# EAGLE design MainBoard v7.1.3 (EAGLE 7.7.0)

## Sheet 1 of 2: Signal Processing
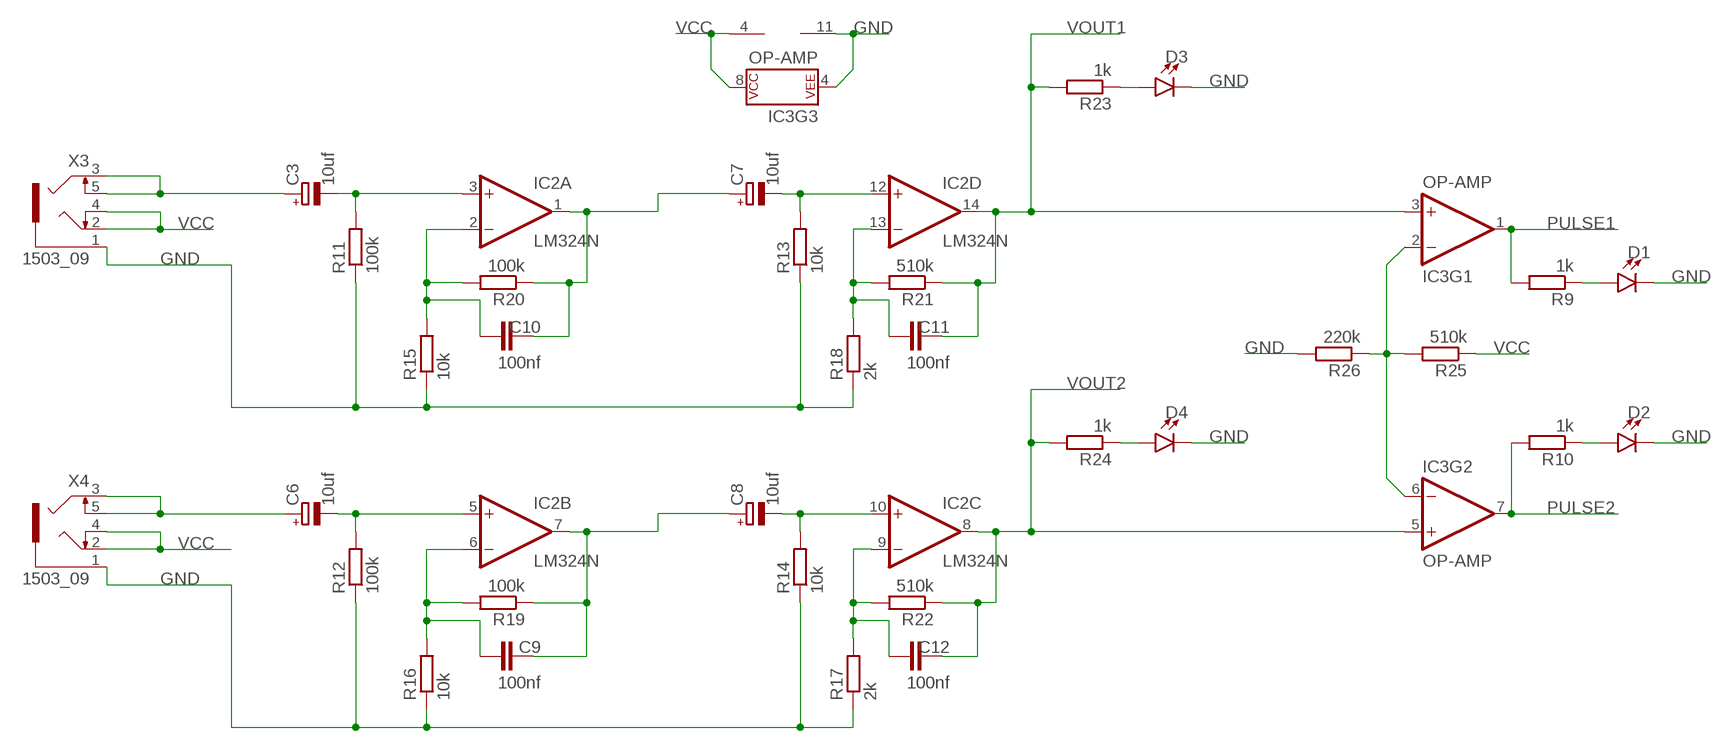
[diagram p0: schematic, sheet 1]

### Parts
C3  10uf  CPOL-EUE2-5  [E2-5]
C6  10uf  CPOL-EUE2-5  [E2-5]
C7  10uf  CPOL-EUE2-5  [E2-5]
C8  10uf  CPOL-EUE2-5  [E2-5]
C9  100nf  C-EU050-030X075  [C050-030X075]
C10  100nf  C-EU050-030X075  [C050-030X075]
C11  100nf  C-EU050-030X075  [C050-030X075]
C12  100nf  C-EU050-030X075  [C050-030X075]
D1  LED5MM  [LED_5MM]
D2  LED5MM  [LED_5MM]
D3  LED5MM  [LED_5MM]
D4  LED5MM  [LED_5MM]
IC2  LM324N  [DIL14]
IC3  OP-AMP  OPAMP-DUALDIP  [DIP08]
R9  1k  R-EU_0207/10  [0207/10]
R10  1k  R-EU_0207/10  [0207/10]
R11  100k  R-EU_0207/10  [0207/10]
R12  100k  R-EU_0207/10  [0207/10]
R13  10k  R-EU_0207/10  [0207/10]
R14  10k  R-EU_0207/10  [0207/10]
R15  10k  R-EU_0207/10  [0207/10]
R16  10k  R-EU_0207/10  [0207/10]
R17  2k  R-EU_0207/10  [0207/10]
R18  2k  R-EU_0207/10  [0207/10]
R19  100k  R-EU_0207/10  [0207/10]
R20  100k  R-EU_0207/10  [0207/10]
R21  510k  R-EU_0207/10  [0207/10]
R22  510k  R-EU_0207/10  [0207/10]
R23  1k  R-EU_0207/10  [0207/10]
R24  1k  R-EU_0207/10  [0207/10]
R25  510k  R-EU_0207/10  [0207/10]
R26  220k  R-EU_0207/10  [0207/10]
X3  1503_09  [1503_09]
X4  1503_09  [1503_09]

### Nets
GND: D1.K(C) D2.K(C) D3.K(C) D4.K(C) IC2.11(P:V-) IC3.4(P$V-) R11.1 R12.1 R13.1 R14.1 R15.1 R16.1 R17.1 R18.1 R26.2 X3.1 X4.1 ; also sheet 2
N$4: C8.+ C9.2 IC2.7(B:OUT) R19.1
N$9: C9.1 IC2.6(B:-IN) R16.2 R19.2
N$11: D1.A R9.1
N$12: C7.+ C10.2 IC2.1(A:OUT) R20.1
N$13: C10.1 IC2.2(A:-IN) R15.2 R20.2
N$15: C11.1 IC2.13(D:-IN) R18.2 R21.2
N$16: IC3.2(-IN) IC3.6(-IN) R25.2 R26.1
N$17: C12.1 IC2.9(C:-IN) R17.2 R22.2
N$18: C6.+ X4.3 X4.5
N$19: D2.A R10.1
N$23: C3.+ X3.3 X3.5
N$24: C6.- IC2.5(B:+IN) R12.2
N$26: C7.- IC2.12(D:+IN) R13.2
N$28: C8.- IC2.10(C:+IN) R14.2
N$35: C3.- IC2.3(A:+IN) R11.2
N$36: D3.A R23.1
N$37: D4.A R24.1
PULSE1: IC3.1(OUT) R9.2 ; also sheet 2
PULSE2: IC3.7(OUT) R10.2 ; also sheet 2
VCC: IC2.4(P:V+) IC3.8(P$V+) R25.1 X3.2 X3.4 X4.2 X4.4 ; also sheet 2
VOUT1: C11.2 IC2.14(D:OUT) IC3.3(+IN) R21.1 R23.2 ; also sheet 2
VOUT2: C12.2 IC2.8(C:OUT) IC3.5(+IN) R22.1 R24.2 ; also sheet 2

## Sheet 2 of 2: Display Segment
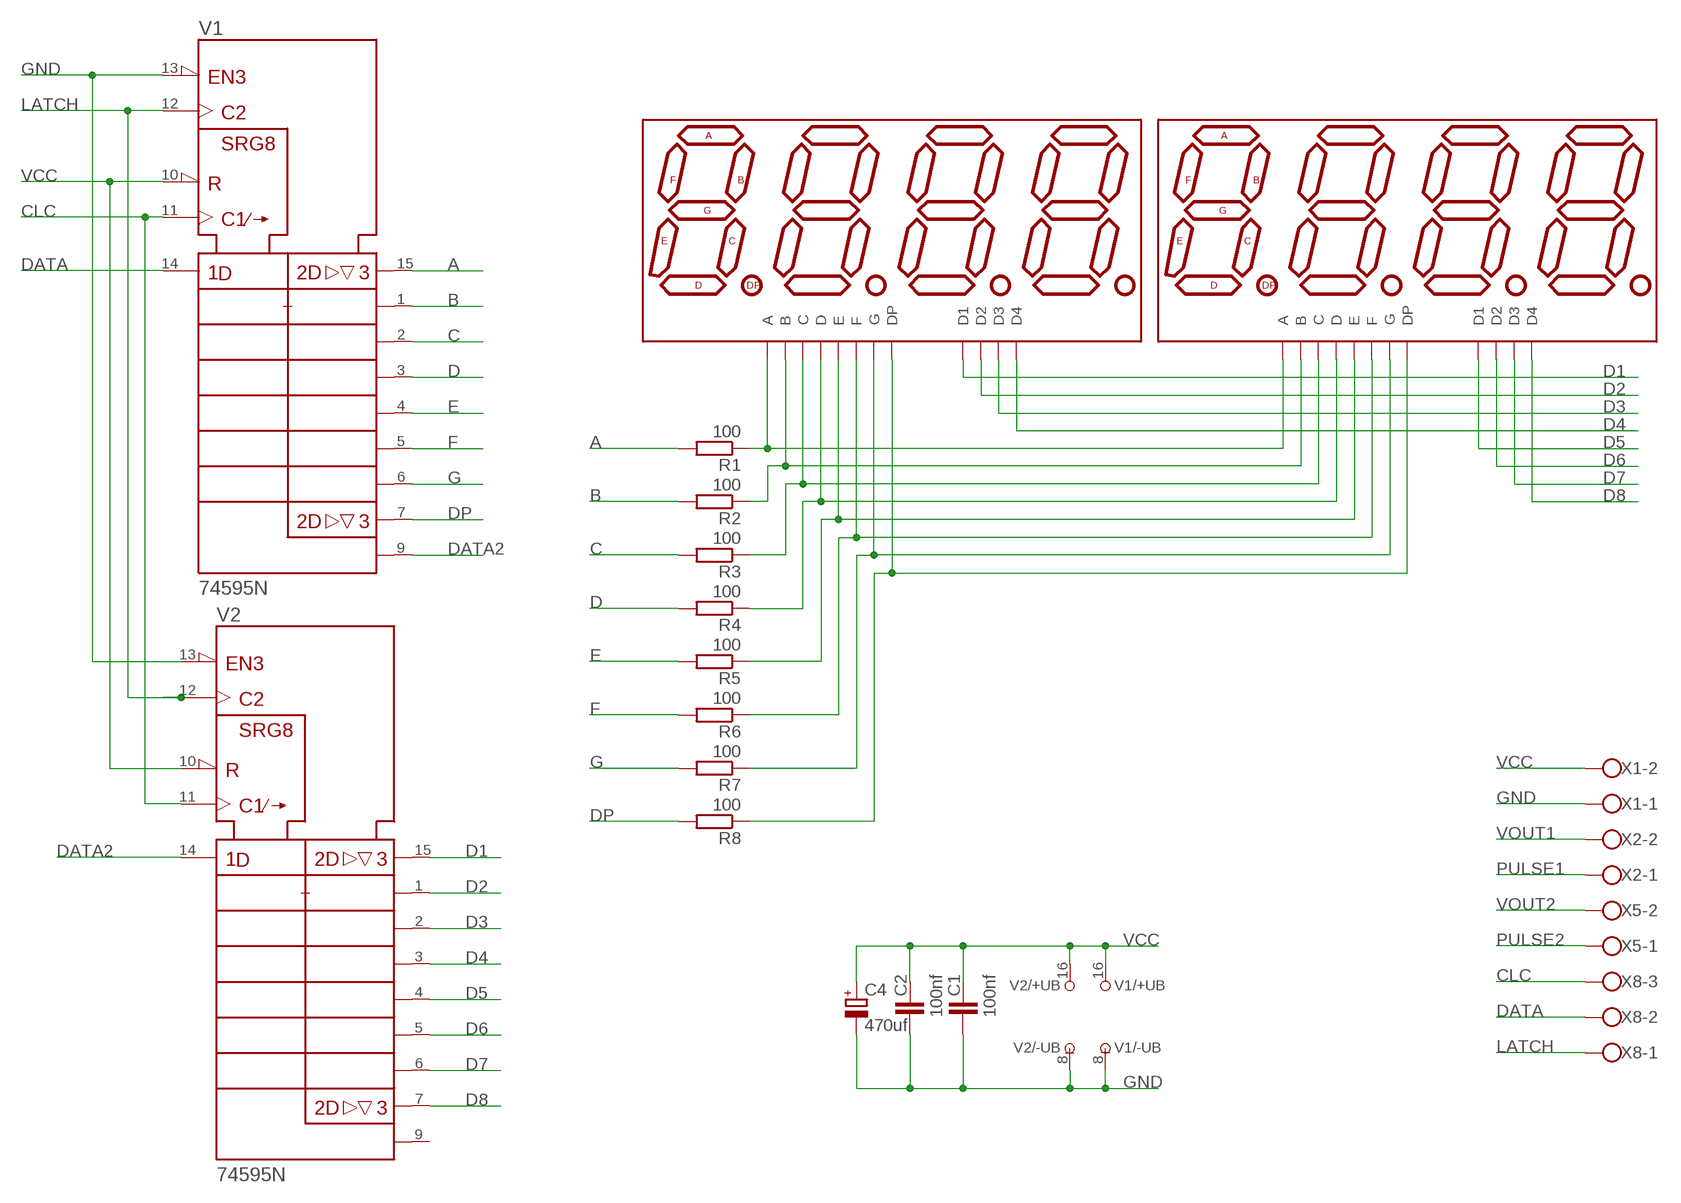
[diagram p1: schematic, sheet 2]

### Parts
C1  100nf  C-EU050-030X075  [C050-030X075]
C2  100nf  C-EU050-030X075  [C050-030X075]
C4  470uf  CPOL-EUE3.5-8  [E3,5-8]
DISP1  ATA8041AB  7-SEGMENT-4DIGIT-20MM-BLUE  [7-SEGMENT-4DIGIT-20MM]
DISP2  ATA8041AB  7-SEGMENT-4DIGIT-20MM-BLUE  [7-SEGMENT-4DIGIT-20MM]
R1  100  R-EU_0207/10  [0207/10]
R2  100  R-EU_0207/10  [0207/10]
R3  100  R-EU_0207/10  [0207/10]
R4  100  R-EU_0207/10  [0207/10]
R5  100  R-EU_0207/10  [0207/10]
R6  100  R-EU_0207/10  [0207/10]
R7  100  R-EU_0207/10  [0207/10]
R8  100  R-EU_0207/10  [0207/10]
V1  74595N  [DIL16]
V2  74595N  [DIL16]
X1  W237-102  [W237-102]
X2  W237-102  [W237-102]
X5  W237-102  [W237-102]
X8  W237-103  [W237-103]

### Nets
A: R1.2 V1.15(QA)
B: R2.2 V1.1(QB)
C: R3.2 V1.2(QC)
CLC: V1.11(SRCK) V2.11(SRCK) X8.3
D: R4.2 V1.3(QD)
D1: DISP2.12(D1) V2.15(QA)
D2: DISP2.9(D2) V2.1(QB)
D3: DISP2.8(D3) V2.2(QC)
D4: DISP2.6(D4) V2.3(QD)
D5: DISP1.12(D1) V2.4(QE)
D6: DISP1.9(D2) V2.5(QF)
D7: DISP1.8(D3) V2.6(QG)
D8: DISP1.6(D4) V2.7(QH)
DATA: V1.14(SER) X8.2
DATA2: V1.9(QH*) V2.14(SER)
DP: R8.2 V1.7(QH)
E: R5.2 V1.4(QE)
F: R6.2 V1.5(QF)
G: R7.2 V1.6(QG)
GND: C1.1 C2.1 C4.- V1.8(-UB) V1.13(!G) V2.8(-UB) V2.13(!G) X1.1 ; also sheet 1
LATCH: V1.12(RCK) V2.12(RCK) X8.1
N$2: DISP1.11(A) DISP2.11(A) R1.1
N$3: DISP1.7(B) DISP2.7(B) R2.1
N$5: DISP1.4(C) DISP2.4(C) R3.1
N$6: DISP1.2(D) DISP2.2(D) R4.1
N$7: DISP1.1(E) DISP2.1(E) R5.1
N$8: DISP1.10(F) DISP2.10(F) R6.1
N$10: DISP1.5(G) DISP2.5(G) R7.1
N$32: DISP1.3(DP) DISP2.3(DP) R8.1
PULSE1: X2.1 ; also sheet 1
PULSE2: X5.1 ; also sheet 1
VCC: C1.2 C2.2 C4.+ V1.10(!SRCLR) V1.16(+UB) V2.10(!SRCLR) V2.16(+UB) X1.2 ; also sheet 1
VOUT1: X2.2 ; also sheet 1
VOUT2: X5.2 ; also sheet 1
Unconnected: V2.9(QH*)

## Library data of the parts
C1 C2 C9-C12 = rcl:C-EU: CAPACITOR, European symbol; SPICEPREFIX: C
C3 C4 C6-C8 = rcl:CPOL-EU: POLARIZED CAPACITOR, European symbol; SPICEPREFIX: C
D1-D4 = SparkFun-LED:LED: LED (Generic) Standard schematic elements and footprints for 5mm, 3mm, 1206, and 0603 sized LEDs. Generic LEDs with no color specified.
DISP1 DISP2 = SparkFun-LED:7-SEGMENT-4DIGIT-20MM: 4 Digit 7 Segment Display This is a part for the 4-Digit 7-segment LEDs from Young Sun. Different from the Digikey LEDs, all 16 pins are used. The LONGPADS Variant is used for a test jig, but you may like it because there is more pad to solder to. If you are concerned about routing space, the standard works just fine though. Datasheets: Red <http://cdn.sparkfun.com/datasheets/Components/LED/1LEDREDCC.pdf> Yellow <http://cdn.sparkfun.com/datasheets/Components/LED/1LEDYELCC.pdf> Green <http://cdn.sparkfun.com/datasheets/Components/LED/1LEDGRNCC.pdf> Blue <http://cdn.sparkfun.com/datasheets/Components/LED/1LEDBLUCC.pdf> White <http://cdn.sparkfun.com/datasheets/Components/LED/1LEDWHTCC.pdf> SparkFun Products Raw Components 7-Segment Display - 20mm (Red) <https://www.sparkfun.com/products/11405> (COM-11405) 7-Segment Display - 20mm (Yellow) <https://www.sparkfun.com/products/11406> (COM-11406) 7-Segment Display - 20mm (Green) <https://www.sparkfun.com/products/11407> (COM-11407) 7-Segment Display - 20mm (Blue) <https://www.sparkfun.com/products/11408> (COM-11408) 7-Segment Display - 20mm (White) <https://www.sparkfun.com/products/11409> (COM-11409) Serial Controlled SparkFun OpenSegment Serial Display - 20mm (Red) <https://www.sparkfun.com/products/11644> (COM-11644) SparkFun OpenSegment Serial Display - 20mm (Yellow) <https://www.sparkfun.com/products/11645> (COM-11645) SparkFun OpenSegment Serial Display - 20mm (Green) <https://www.sparkfun.com/products/11646> (COM-11646) SparkFun OpenSegment Serial Display - 20mm (Blue) <https://www.sparkfun.com/products/11647> (COM-11647) SparkFun OpenSegment Serial Display - 20mm (White) <https://www.sparkfun.com/products/11648> (COM-11648) Other SparkFun OpenSegment Shield <https://www.sparkfun.com/products/13190> (DEV-13190); PROD_ID: COMP-11446
IC2 = linear:LM324: OP AMP
IC3 = SparkFun-IC-Amplifiers:OPAMP-DUAL: Generic op-amp footprint This component is for the standard 358 pinning of a dual op-amp From the LM358 datasheet: Pin 1: Output A Pin 2: Inverting Input A Pin 3: Non-Inverting Input A Pin 4: Gnd Pin 5: Non-Inverting Input B Pin 6: Inverting Input B Pin 7: Output B Pin 8: V+; PROD_ID: NA-XXXXX
R1-R26 = rcl:R-EU_: RESISTOR, European symbol; SPICEPREFIX: R
V1 V2 = 74ttl-din:74*595: 8-bit SHIFT REGISTER, output latch
X1 X2 X5 = con-wago-500:W237-102: WAGO SCREW CLAMP; MPN: 237-102; OC_FARNELL: unknown; OC_NEWARK: 70K9898
X3 X4 = con-lumberg:1503_09: Jack connectors according to JISC 6560, 3.5 mm Klinkeneinbaukupplung nach JISC 6560, 3,5 mm, 3-polig/ stereo, abgewinkelte Ausführung, mit 2 Öffnern und Lötaugen, für Leiterplatten Rückseitenmontage Source: http://www.lumberg.com/Produkte/PDFs/1503_09.pdf; OC_FARNELL: 1243244; OC_NEWARK: unknown
X8 = con-wago-500:W237-103: WAGO SCREW CLAMP; MPN: 237-103; OC_FARNELL: unknown; OC_NEWARK: 18M7116

## Board
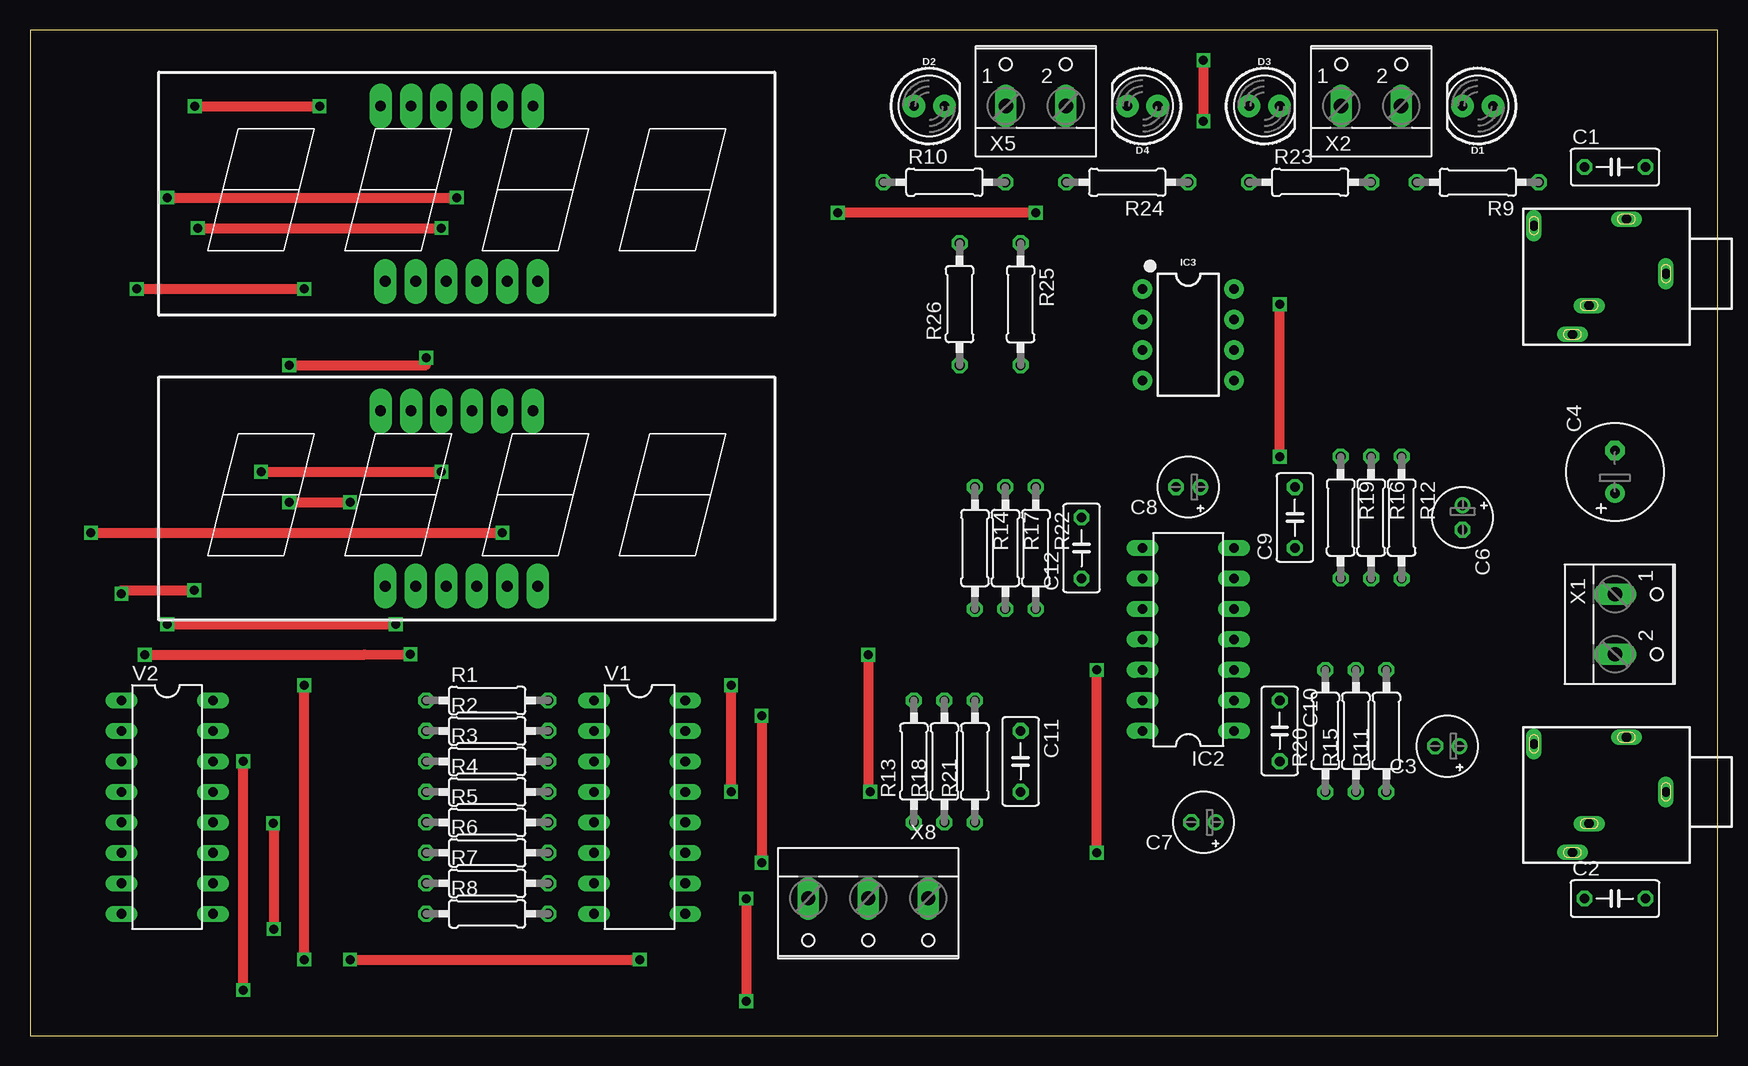
[diagram p2: board, top side]
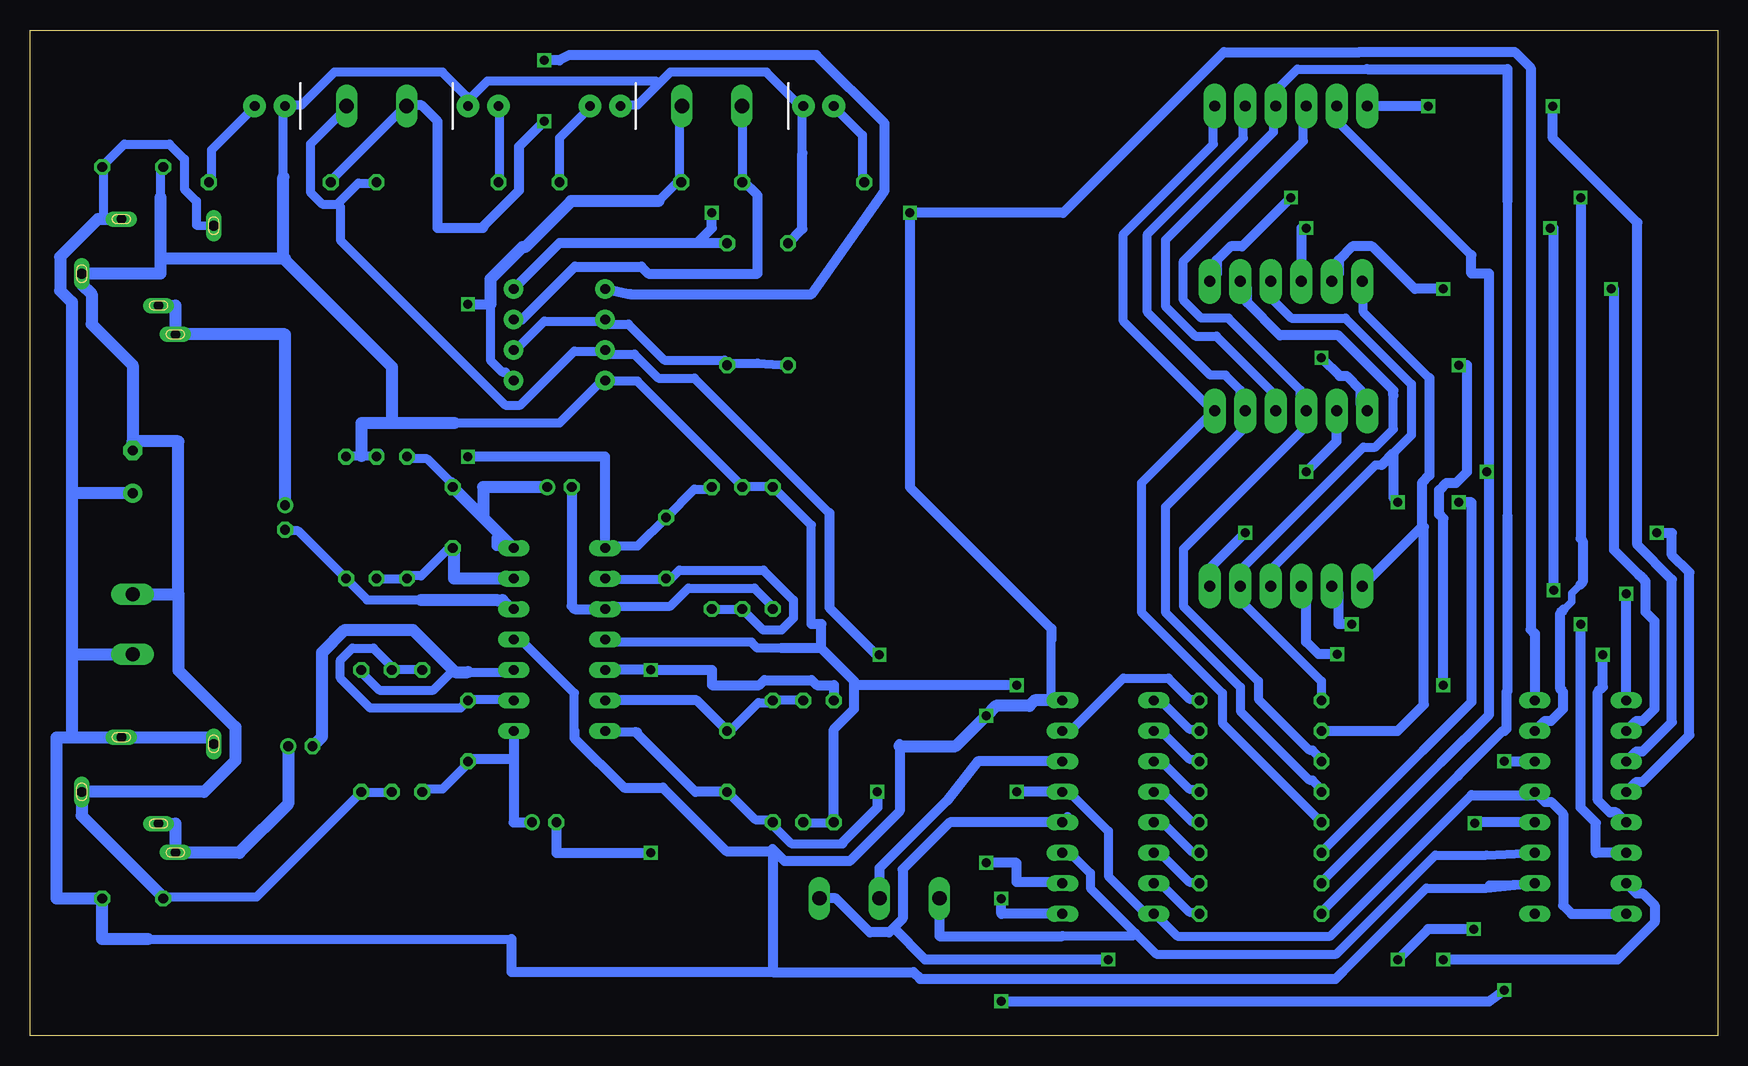
[diagram p3: board, bottom side, seen from below]

Size 140.64 x 83.81 mm. Coordinates in mm from the lower left corner, seen from the top.
Outline: 0,0 140.64,0 140.64,83.81 0,83.81 0,0
Copper layers (1*16): Top 0.035mm / dielectric 1.5mm / Bottom 0.035mm
Design rules "default *": minimum track width 30mil, minimum drill 0.35mm, track to track 25mil, track to pad 25mil, pad to pad 6mil, via to via 6mil, smd to smd 6mil, copper to edge 40mil, drill to drill 6mil, minimum pad ring 10mil, minimum via ring 8mil, stop-mask expansion 4mil, vias tented up to drill 0mil, thermal gap 10mil

### Footprints (pad centres in the part's own frame; a part is rotated, then mirrored left to right if it is on the bottom)
C050-030X075 = drill 0.813 octagon: 1 -2.54,0; 2 2.54,0
E2-5 = drill 0.813 pad 1.27: + -1.016,0 | drill 0.813 pad 1.27 octagon: - 1.016,0
E3,5-8 = drill 0.813 pad 1.6: + -1.778,0 | drill 0.813 pad 1.6 octagon: - 1.778,0
LED_5MM = drill 0.813 pad 1.88: A -1.27,0; K 1.27,0
7-SEGMENT-4DIGIT-20MM = drill 0.9 pad 1.88 long: 1 -5.512,-6.985; 2 -2.972,-6.985; 3 -0.432,-6.985; 4 2.108,-6.985; 5 4.648,-6.985; 6 7.188,-6.985; 7 6.782,7.62; 8 4.242,7.62; 9 1.702,7.62; 10 -0.838,7.62; 11 -3.378,7.62; 12 -5.918,7.62
DIL14 = drill 0.813 long: 1 -7.62,-3.81; 2 -5.08,-3.81; 3 -2.54,-3.81; 4 0,-3.81; 5 2.54,-3.81; 6 5.08,-3.81; 7 7.62,-3.81; 8 7.62,3.81; 9 5.08,3.81; 10 2.54,3.81; 11 0,3.81; 12 -2.54,3.81; 13 -5.08,3.81; 14 -7.62,3.81
DIP08 = drill 0.813 pad 1.626: 1 -3.81,-3.81; 2 -1.27,-3.81; 3 1.27,-3.81; 4 3.81,-3.81; 5 3.81,3.81; 6 1.27,3.81; 7 -1.27,3.81; 8 -3.81,3.81
0207/10 = drill 0.813 octagon: 1 -5.08,0; 2 5.08,0
DIL16 = drill 0.813 long: 1 -8.89,-3.81; 2 -6.35,-3.81; 3 -3.81,-3.81; 4 -1.27,-3.81; 5 1.27,-3.81; 6 3.81,-3.81; 7 6.35,-3.81; 8 8.89,-3.81; 9 8.89,3.81; 10 6.35,3.81; 11 3.81,3.81; 12 1.27,3.81; 13 -1.27,3.81; 14 -3.81,3.81; 15 -6.35,3.81; 16 -8.89,3.81
W237-102 = drill 1.194 long: 1 -2.5,-1.27; 2 2.5,-1.27
1503_09 = drill 0.8 pad 1.2 long: 1 0,-2.1; 2 -4.55,-5.4; 3 5.05,-9.9; 4 -4,-13.1; 5 2.65,-8.5
W237-103 = drill 1.194 long: 1 -5,-1.29; 2 0,-1.29; 3 5,-1.29

### Placement (x,y rotation side)
C1  132.08,72.39 0 top
C2  132.08,11.43 0 top
C3  118.11,24.13 180 top
C4  132.08,46.99 90 top
C6  119.38,43.18 270 top
C7  97.79,17.78 180 top
C8  96.52,45.72 180 top
C9  105.41,43.18 90 top
C10  104.14,25.4 270 top
C11  82.55,22.86 270 top
C12  87.63,40.64 90 top
D1  120.65,77.47 180 top
D2  74.93,77.47 0 top
D3  102.87,77.47 0 top
D4  92.71,77.47 180 top
DISP1  36.4,45.09 180 top
DISP2  36.4,70.48 180 top
IC2  96.52,33.02 90 top
IC3  96.52,58.42 270 top
R1  38.1,27.94 0 top
R2  38.1,25.4 0 top
R3  38.1,22.86 0 top
R4  38.1,20.32 0 top
R5  38.1,17.78 0 top
R6  38.1,15.24 0 top
R7  38.1,12.7 0 top
R8  38.1,10.16 0 top
R9  120.65,71.12 180 top
R10  76.2,71.12 0 top
R11  113.03,25.4 90 top
R12  114.3,43.18 270 top
R13  73.66,22.86 90 top
R14  78.74,40.64 270 top
R15  110.49,25.4 90 top
R16  111.76,43.18 270 top
R17  81.28,40.64 270 top
R18  76.2,22.86 90 top
R19  109.22,43.18 270 top
R20  107.95,25.4 90 top
R21  78.74,22.86 90 top
R22  83.82,40.64 270 top
R23  106.68,71.12 0 top
R24  91.44,71.12 180 top
R25  82.55,60.96 270 top
R26  77.47,60.96 90 top
V1  50.8,19.05 270 top
V2  11.43,19.05 270 top
X1  133.35,34.29 270 top
X2  111.76,78.74 0 top
X3  138.43,20.32 270 top
X4  138.43,63.5 270 top
X5  83.82,78.74 0 top
X8  69.85,10.16 180 top

### Tracks (layer width: path | path; a pad name or v marks a point on that pad's centre or on a via)
A
  Bottom 0.762: R1.2 43.27,28.04 44.02,28.04 45.77,29.79 49.52,29.79 53.77,25.54 54.52,25.54 V1.15
B
  Bottom 0.762: R2.2 43.27,25.54 44.02,25.54 46.27,27.79 46.77,27.79 V1.1
C
  Bottom 0.762: R3.2 43.27,23.04 44.02,23.04 46.27,25.29 46.77,25.29 V1.2
CLC
  Bottom 0.762: 48.52,8.54 52.27,12.29 52.27,13.54 53.77,15.04 54.52,15.04 V1.11 | 48.52,8.54 46.77,6.79 31.77,6.79 23.52,15.04 19.27,15.04 V2.11 | 56.02,8.29 54.61,8.29 48.77,8.29 48.52,8.54
  Bottom 0.813: X8.3 64.85,8.29 54.61,8.29
D
  Bottom 0.762: R4.2 43.27,20.54 44.02,20.54 46.27,22.79 46.77,22.79 V1.3
D1  (via drill 0.75 pad 0.6)
  Top 0.813: v11.43,69.85 v35.56,69.85
  Bottom 0.61: 12.85,35.5 12.75,35.6 12.71,35.6 12.16,36.15 12.16,36.88 11.25,37.79
  Bottom 0.813: DISP2.12 41.76,63.42 41.76,64.62 40.6,65.79 39.62,65.79 v35.56,69.85 | v11.43,69.85 11.43,41.42 11.25,41.24 11.25,37.79 11.43,37.61 | V2.15 14.4,26.24 13.88,26.24 12.88,27.23 12.88,28.64 13.1,28.87 13.1,35.25 12.85,35.5
D2  (via drill 0.75 pad 0.6)
  Top 0.813: v13.97,67.31 v34.29,67.31 | v7.62,36.83 7.62,37.12 v13.68,37.12
  Bottom 0.813: v34.29,67.31 34.7,67.31 DISP2.9 | V2.1 v7.62,36.83 | v13.97,67.31 13.68,67.31 v13.68,37.12
D3  (via drill 0.75 pad 0.6)
  Top 0.813: v8.89,62.23 v22.86,62.23
  Bottom 0.813: V2.2 6.78,26.24 6.25,26.24 5.26,27.23 5.26,34.56 6,35.3 6,37.84 6.3,38.15 6.61,38.45 8.63,40.47 8.63,62.23 v8.89,62.23 | v22.86,62.23 25.24,62.23 28.8,65.79 30.44,65.79 31.6,64.62 31.6,63.42 DISP2.8
D4  (via drill 0.75 pad 0.6)
  Top 0.813: v13.73,77.47 v24.13,77.47
  Bottom 0.813: V2.3 6.78,23.7 6.25,23.7 3.81,26.14 3.81,38.01 6.7,40.9 6.7,67.75 13.73,74.78 v13.73,77.47 | v24.13,77.47 DISP2.6
D5  (via drill 0.75 pad 0.6)
  Top 0.813: v5.08,41.91 v39.37,41.91
  Bottom 0.813: V2.4 6.78,21.16 6.25,21.16 2.36,25.05 2.36,38.61 3.81,40.06 3.81,41.91 v5.08,41.91 | v39.37,41.91 42.32,38.96 DISP1.12
D6  (via drill 0.75 pad 0.6)
  Top 0.813: v9.57,31.75 27.89,31.75 v31.7,31.8
  Bottom 0.813: v31.7,31.8 33.26,31.8 34.29,32.82 34.29,37.47 DISP1.9 | V2.5 8.46,18.62 8.98,18.62 9.98,19.61 9.98,28.64 9.57,29.06 v9.57,31.75
D7  (via drill 0.75 pad 0.6)
  Top 0.813: v11.43,34.29 v30.48,34.29
  Bottom 0.813: DISP1.8 31.6,36.91 31.6,35.7 31.6,34.29 v30.48,34.29 | V2.6 10.16,15.24 10.16,17.75 11.43,19.02 v11.43,34.29
D8  (via drill 0.75 pad 0.6)
  Top 0.813: v22.86,6.35 v22.86,29.21 | v21.59,55.88 33.02,55.88 v33.02,56.51
  Bottom 0.813: V2.7 6.78,11.86 6.25,11.86 5.26,10.87 5.26,9.46 8.36,6.35 v22.86,6.35 | v22.86,29.21 22.86,43.09 23.21,43.44 23.21,45.46 22.6,46.07 21.79,46.07 20.87,46.99 20.87,55.88 v21.59,55.88 | v33.02,56.51 31.5,54.99 30.93,54.99 29.77,53.83 29.77,52.63 DISP1.6
DATA
  Bottom 0.813: V1.14 61.66,22.86 64.2,19.62 69.85,13.97 X8.2
DATA2  (via drill 0.75 pad 0.6)
  Top 0.813: v59.69,11.43 v59.69,2.87 | v17.78,3.81 v17.78,22.86
  Bottom 0.813: V1.9 59.69,10.16 v59.69,11.43 | v59.69,2.87 19.05,2.87 v17.78,3.81 | v17.78,22.86 V2.14
DP
  Bottom 0.762: R8.2 43.27,10.29 44.02,10.29 46.27,12.54 46.77,12.54 V1.7
E
  Bottom 0.762: R5.2 43.27,17.79 43.77,17.79 46.27,20.29 46.77,20.29 V1.4
F
  Bottom 0.762: R6.2 43.27,15.29 43.77,15.29 46.02,17.54 46.77,17.54 V1.5
G
  Bottom 0.762: R7.2 43.27,12.79 44.02,12.79 46.27,15.04 46.77,15.04 V1.6
GND  (via drill 0.75 pad 0.6)
  Top 0.813: v58.42,20.32 v58.42,29.21
  Bottom 0.762: R13.1 73.69,17.75 76.19,17.75 R18.1 | 78.02,32.29 80.02,32.29 80.52,32.79 92.52,32.79 IC2.11 | R12.1 114.29,48.33 113.03,48.33 111.79,48.33 R16.1 111.54,48.58 | 105.27,51.04 96.52,51.04 93.02,54.54 IC3.4 92.52,54.54 90.02,54.54 81.52,46.04 R17.1 81.27,45.79 78.77,45.79 R14.1 78.52,45.54 75.52,42.54 75.52,34.29 | 76.27,73.54 76.27,77.29 D2.K 76.52,77.54 79.27,80.29 87.27,80.29 88.27,79.29 | 88.27,79.29 90.02,77.54 91.27,77.54 D4.K | 88.27,79.29 88.52,79.54 102.52,79.54 104.02,78.04 104.02,77.54 D3.K 104.27,78.29 106.27,80.29 115.27,80.29 118.02,77.54 119.27,77.54 D1.K 119.52,77.29 119.52,71.54 | R15.1 110.52,20.29 113.02,20.29 R11.1 113.27,20.04 121.77,11.54 129.52,11.54 C2.1 | 129.77,69.54 129.77,69.85 129.77,72.29 C1.1 | V1.13 54.52,20.29 54.02,20.29 50.77,17.04 50.77,13.29 47.77,10.29 47.02,10.29 V1.8 46.77,10.04 45.02,8.29 32.27,8.29 20.52,20.04
  Bottom 0.813: R26.2 76.27,67.24 76.27,73.54 | R13.1 73.66,25.53 71.96,27.23 71.96,29.21 | 74.69,32.29 78.02,32.29 | 74.69,32.29 71.96,29.56 71.96,29.21 | 74.69,32.29 74.69,34.29 75.52,34.29 | 20.52,20.04 15.24,20.04 V2.13 14.4,19.48 13.88,19.48 12.88,18.48 12.88,10.87 12.17,10.16 V2.8 | V1.13 v58.42,20.32 | v58.42,29.21 71.96,29.21
  Bottom 1.016: 129.77,69.85 129.77,64.77 | 129.77,64.77 129.77,63.5 X4.1 136.33,62.64 135.51,61.82 135.51,59.31 132.08,55.88 132.08,49.53 | 132.08,49.53 C4.- | X1.1 128.27,36.79 | 128.27,36.79 128.27,49.53 132.08,49.53 | 105.27,51.04 110.49,51.04 | 110.49,51.04 113.03,51.04 113.03,48.33 | 128.27,36.79 128.27,30.45 123.53,25.72 123.53,22.92 126.14,20.32 X3.1 136.33,18.35 129.52,11.54 | 129.77,64.77 119.52,64.77 | 119.38,64.77 119.52,64.77 | 119.52,64.77 119.52,71.54 | 119.52,64.77 110.49,55.74 110.49,51.04
LATCH  (via drill 0.75 pad 0.6)
  Top 0.813: v20.25,17.71 20.32,17.71 v20.32,8.89 | v26.67,6.35 v50.8,6.35
  Bottom 0.813: 54.18,18.21 V1.12 63.99,17.78 67.91,13.86 67.91,9.75 68.68,8.99 | 68.68,8.99 69.05,8.62 70.65,8.62 73.48,11.45 X8.1 | V2.12 20.25,17.78 | 20.32,17.78 20.25,17.78 | 20.25,17.78 v20.25,17.71 | v20.32,8.89 24.13,8.89 v26.67,6.35 | v50.8,6.35 66.04,6.35 68.68,8.99
N$2
  Bottom 0.762: R1.1 33.02,29.54 39.77,36.29 39.77,37.29 DISP1.11 39.77,37.79 39.77,38.79 29.52,49.04 28.52,49.04 27.02,50.54 27.02,53.34 27.02,53.79 | 39.77,61.54 39.77,62.79 DISP2.11
  Bottom 0.813: 27.02,53.34 27.02,53.78 31.61,58.37 36.48,58.37 39.22,61.1 39.22,62.31 DISP2.11
N$3
  Bottom 0.762: 33.02,25.54 R2.1 | 29.77,37.29 DISP1.7 29.52,37.79 | 24.02,54.79 29.52,60.29 29.52,62.79 DISP2.7
  Bottom 0.813: 24.02,54.79 24.02,46.7 24.66,46.06 24.66,42.4 | 24.66,42.4 29.77,37.29 | R2.1 26.67,25.4 24.48,27.59 24.48,42.4 24.66,42.4
N$4
  Bottom 0.762: 101.77,40.79 100.52,40.79 IC2.7 | 105.29,45.58 C9.2 105.54,46.08 107.54,48.08 109.04,48.08 R19.1
  Bottom 0.813: 101.77,41.49 101.77,40.79
  Bottom 1.016: IC2.7 102.87,43.18 | 102.87,43.18 105.54,45.85 105.54,46.08 | C8.+ 102.87,45.72 102.87,43.18
N$5
  Bottom 0.762: R3.1 33.02,23.04 33.77,23.79 34.02,23.79 38.27,28.04 38.27,29.54 44.52,35.79 44.52,40.54 34.52,50.54 34.52,52.04 DISP1.4 34.77,52.29 34.77,53.79 40.77,59.79 43.02,59.79 44.52,61.29 44.52,64.54 34.52,74.54 34.52,77.29 DISP2.4
N$6
  Bottom 0.762: R4.1 33.02,20.54 33.77,21.29 34.02,21.29 39.77,27.04 39.77,29.04 46.02,35.29 46.02,44.04 39.52,50.54 39.52,52.04 DISP1.2 39.77,52.29 39.77,53.79 41.02,55.04 42.27,55.04 47.52,60.29 47.52,66.79 39.52,74.79 39.52,77.29 DISP2.2
N$7
  Bottom 0.762: R5.1 41.27,26.04 41.27,28.54 48.02,35.29 48.02,46.04 42.02,52.04 DISP1.1 42.27,52.29 49.52,59.54 49.52,66.79 42.02,74.29 42.02,77.29 DISP2.1
N$8  (via drill 0.75 pad 0.6)
  Top 0.813: v21.59,44.45 v26.67,44.45
  Bottom 0.762: 24.52,23.79 33.02,15.29 R6.1 | 37.02,64.29 37.02,63.04 DISP2.10 37.27,62.54 37.27,61.54 35.52,59.79 31.02,59.79 25.52,54.29 25.52,50.04 28.02,47.54 28.52,47.54 37.02,39.04 37.02,37.54 DISP1.10
  Bottom 0.813: v26.67,44.45 26.98,44.76 26.98,48.57 27.93,47.62 27.94,47.62 28.02,47.54 | 24.52,23.79 20.5,27.81 20.5,44.45 v21.59,44.45
N$9
  Bottom 0.762: R16.2 111.54,38.08 109.29,38.08 R19.2 109.04,38.33 108.04,38.33 105.79,40.58 C9.1 105.29,40.58 | 100.52,38.04 IC2.6
  Bottom 1.016: IC2.6 105.29,38.1 105.29,40.58
N$10  (via drill 0.75 pad 0.6)
  Top 0.813: v19.25,46.99 v34.29,46.99
  Bottom 0.762: 23.02,22.79 33.02,12.79 R7.1 | 20.52,65.04 31.52,76.04 31.52,77.29 DISP2.5
  Bottom 0.813: v34.29,46.99 31.75,49.53 DISP1.5 | 23.02,22.79 19.05,26.76 19.05,46.99 | 19.05,46.99 19.05,63.5 20.52,63.5 20.52,65.04 | 19.05,46.99 v19.25,46.99
N$11
  Bottom 0.762: R9.1 125.52,71.29 125.52,73.79 122.02,77.29 D1.A
N$12
  Bottom 0.762: 100.27,25.29 IC2.1 | 104.02,23.04 C10.2 104.27,22.54 106.27,20.54 107.77,20.54 R20.1
  Bottom 0.813: IC2.1 100.33,23.04 | 100.33,23.04 104.02,23.04 | 100.33,23.04 100.33,17.78 C7.+
N$13
  Bottom 0.762: R20.2 108.02,30.54 110.27,30.54 R15.2 110.52,30.79 112.02,32.29 113.77,32.29 114.77,31.29 114.77,29.79 112.27,27.29 104.77,27.29 104.27,27.79 C10.1 104.02,28.04 100.52,28.04 IC2.2
N$15
  Bottom 0.762: R18.2 76.44,28 78.69,28 R21.2 78.94,27.75 79.94,27.75 82.19,25.5 C11.1 82.69,25.5 | 92.52,28.04 IC2.13
  Bottom 0.813: C11.1 85.09,27.94 IC2.13
N$16
  Bottom 0.762: R26.1 80.02,56.04 82.52,56.04 R25.2 82.77,56.29 87.77,56.29 90.77,59.29 92.52,59.29 IC3.2 92.77,59.54 97.77,59.54 100.27,57.04 IC3.6
N$17
  Bottom 0.762: R22.2 83.77,35.54 81.52,35.54 R17.2 81.02,35.29 79.52,33.79 78.02,33.79 77.02,34.79 77.02,36.29 79.52,38.79 86.52,38.79 87.27,38.04 C12.1 87.77,38.04 92.52,38.04 IC2.9
N$18
  Bottom 1.016: X4.5 128.53,60.85 X4.3 119.38,58.45 C6.+
N$19
  Bottom 0.762: R10.1 71.27,71.29 71.27,75.04 73.52,77.29 D2.A
N$23
  Bottom 1.016: X3.5 128.53,17.67 X3.3 128.53,15.24 123.19,15.24 119.13,19.3 C3.+
N$24
  Bottom 0.762: 108.04,36.33 112.54,36.33 114.29,38.08 R12.2 114.54,38.33 118.29,42.08 119.29,42.08 C6.- | 100.52,35.54 IC2.5
  Bottom 1.016: 108.04,36.33 101.77,36.33 101.74,36.3 101.28,36.3 100.52,35.54
N$26  (via drill 0.75 pad 0.6)
  Top 0.813: v88.9,15.24 v88.9,30.48
  Bottom 0.813: IC2.12 v88.9,30.48 83.82,30.48 83.82,29.21 79.88,29.21 79.44,29.64 75.5,29.64 75.06,29.21 73.66,29.21 R13.2 | C7.- 96.77,15.24 v88.9,15.24
N$28
  Bottom 0.762: R14.2 78.77,35.79 80.27,37.29 85.77,37.29 87.27,35.79 92.52,35.79 IC2.10
  Bottom 0.813: IC2.10 95.25,35.56 95.5,35.81 C8.-
N$32
  Bottom 0.762: 21.52,21.79 21.66,21.66 33.02,10.29 R8.1 | 17.52,69.54 17.52,43.29 | 28.52,80.54 29.21,80.54 35.02,80.54 36.77,78.79 36.77,77.54 DISP2.3 37.02,77.29 37.02,75.29 46.02,66.29 46.02,60.79 43.52,58.29 41.77,58.29 37.02,53.54 37.02,52.29 DISP1.3
  Bottom 0.813: 29.21,80.54 17.52,80.54 17.52,69.54 | 17.52,43.29 17.52,28.73 17.6,28.64 17.6,25.58 17.78,25.4 17.91,25.4 21.66,21.66
N$35
  Bottom 0.762: IC2.3 100.52,30.29 104.14,30.29 105.52,30.29 107.02,28.79 111.52,28.79 113.02,30.29 R11.2
  Bottom 1.016: C3.- 116.29,24.93 116.29,31.92 114.4,33.81 108.73,33.81 105.21,30.29 104.14,30.29
N$36
  Bottom 0.762: R23.1 101.52,71.29 101.52,77.29 D3.A
N$37
  Bottom 0.762: R24.1 96.52,74.79 94.02,77.29 D4.A
PULSE1  (via drill 0.75 pad 0.6)
  Top 0.813: v97.79,81.28 v97.79,76.2
  Bottom 0.762: R9.2 115.52,71.29 109.28,77.53 109.27,77.54 X2.1
  Bottom 0.813: IC3.1 90.6,61.8 75.5,61.8 69.42,70.42 69.42,76.03 75.1,81.71 95.68,81.71 96.52,81.28 v97.79,81.28 | v97.79,76.2 99.9,74.09 99.9,70.42 102.87,67.44 102.87,67.31 106.68,67.31 106.68,76.2 108.01,77.53 109.28,77.53
PULSE2
  Bottom 0.762: R10.2 81.27,71.29 81.27,77.29 X5.1
  Bottom 0.813: IC3.7 99.63,59.69 95.24,64.08 89.69,64.08 89.1,63.5 80.01,63.5 80.01,70.03 81.27,71.29
VCC  (via drill 0.75 pad 0.6)
  Top 0.813: v83.82,68.58 v67.31,68.58 | v60.96,26.67 v60.96,14.4
  Bottom 0.762: X4.4 126.77,67.54 126.77,69.54 127.77,70.54 127.77,73.04 129.02,74.29 132.77,74.29 134.52,72.54 C1.2 134.52,72.04 134.52,68.29 X4.2 | 17.02,12.54 19.02,12.54 V2.10 19.27,12.29 24.27,12.29 31.27,5.29 | 55.27,12.79 54.77,12.79 V1.10 | 55.27,27.79 54.77,27.79 V1.16 55.52,28.04 55.52,33.02 55.52,33.79 | 95.27,24.79 95.27,25.4 95.27,28.54 99.52,32.79 100.27,32.79 IC2.4 | 82.27,65.79 R25.1 | 131.02,8.04 130.81,8.04 100.52,8.04
  Bottom 0.813: R25.1 85.09,66.04 | 85.09,66.04 96.52,66.04 IC3.8 | 85.09,66.04 83.82,67.31 v83.82,68.58 | 55.52,33.02 55.52,33.93 67.31,45.72 v67.31,68.58 54.54,68.58 41.16,81.96 29.84,81.96 29.81,81.99 16.92,81.99 15.59,80.66 15.59,33.86 15.24,33.51 V2.16 16.1,27.94 | 78.75,5.29 100.52,5.29 100.52,8.04 | 68.17,24.31 68.17,24.13 68.17,18.73 72.34,14.55 77.75,14.55 78.59,15.39 | 78.59,15.39 78.75,15.54 78.75,5.29 | 95.27,25.4 95.27,24.81 91.13,20.67 87.89,20.67 82.61,15.39 78.59,15.39 | 31.27,5.29 31.83,4.73 66.47,4.73 67.03,5.29 78.75,5.29 | v60.96,14.4 58.42,14.4 58.42,12.79 54.77,12.79
  Bottom 1.016: V1.16 56.92,27.94 57.37,27.49 60.14,27.49 v60.96,26.67 63.5,24.13 68.17,24.13 | X4.2 134.97,68.05 138.13,64.9 138.13,62.1 137.16,61.13 137.16,45.21 | 137.16,31.79 X1.2 | 137.16,45.21 137.16,31.79 | C4.+ 137.16,45.21 | 137.16,31.79 137.16,24.87 | 137.16,24.87 X3.2 125.33,24.87 X3.4 | 130.81,8.04 134.62,8.04 C2.2 138.43,11.43 138.43,24.87 137.16,24.87
VOUT1  (via drill 0.75 pad 0.6)
  Top 0.813: v69.85,31.75 69.85,20.32 v70.03,20.32
  Bottom 0.762: 90.02,25.29 90.17,25.29 92.52,25.29 IC2.14 | 82.69,20.5 C11.2 82.44,20.25 80.19,18 78.94,18 R21.1 78.69,17.5 77.19,16 72.94,16 | 115.02,69.29 113.27,71.04 111.77,71.04 R23.2 | 115.02,69.29 116.27,69.29 117.27,70.29 117.27,74.29 114.27,77.29 X2.2 | 115.02,69.29 114.77,69.04 114.77,66.29 101.02,52.54 99.77,52.54 95.27,57.04 92.77,57.04 IC3.3 92.52,56.79 90.27,56.79 88.27,54.79 85.27,54.79 74.02,43.54
  Bottom 0.813: C11.2 85.2,20.32 90.17,25.29 | 74.02,43.54 74.02,35.66 70.11,31.75 v69.85,31.75 | 72.94,16 72.94,16.09 70.03,19.01 v70.03,20.32
VOUT2  (via drill 0.75 pad 0.6)
  Top 0.813: v104.14,48.26 v104.14,60.96
  Bottom 0.762: R22.1 84.02,45.54 85.27,45.54 C12.2 90.02,40.79 92.52,40.79 IC2.8 | X5.2 86.52,77.29 86.52,71.29 R24.2 86.77,71.04 88.27,69.54 | 102.27,63.04 102.27,60.96 102.27,56.29 101.27,55.29 101.02,55.29 100.52,54.79 IC3.5
  Bottom 0.813: IC2.8 92.71,48.26 v104.14,48.26 | v104.14,60.96 102.27,60.96
  Bottom 1.016: 88.27,69.54 95.55,69.54 99.37,65.72 99.61,65.72 102.29,63.04 102.29,60.96 102.27,60.96

### Text on the board
tValues: CH1 | CH1 | CH2 | GND | VCC | CH2 | HR and Respiration Counter | BY FEE BME | V 7.1 | CLC | DAT | LAT